# Altium schematic sheet GPS_test.SchDoc
size A; SheetNumber: 3; SheetTotal: 5
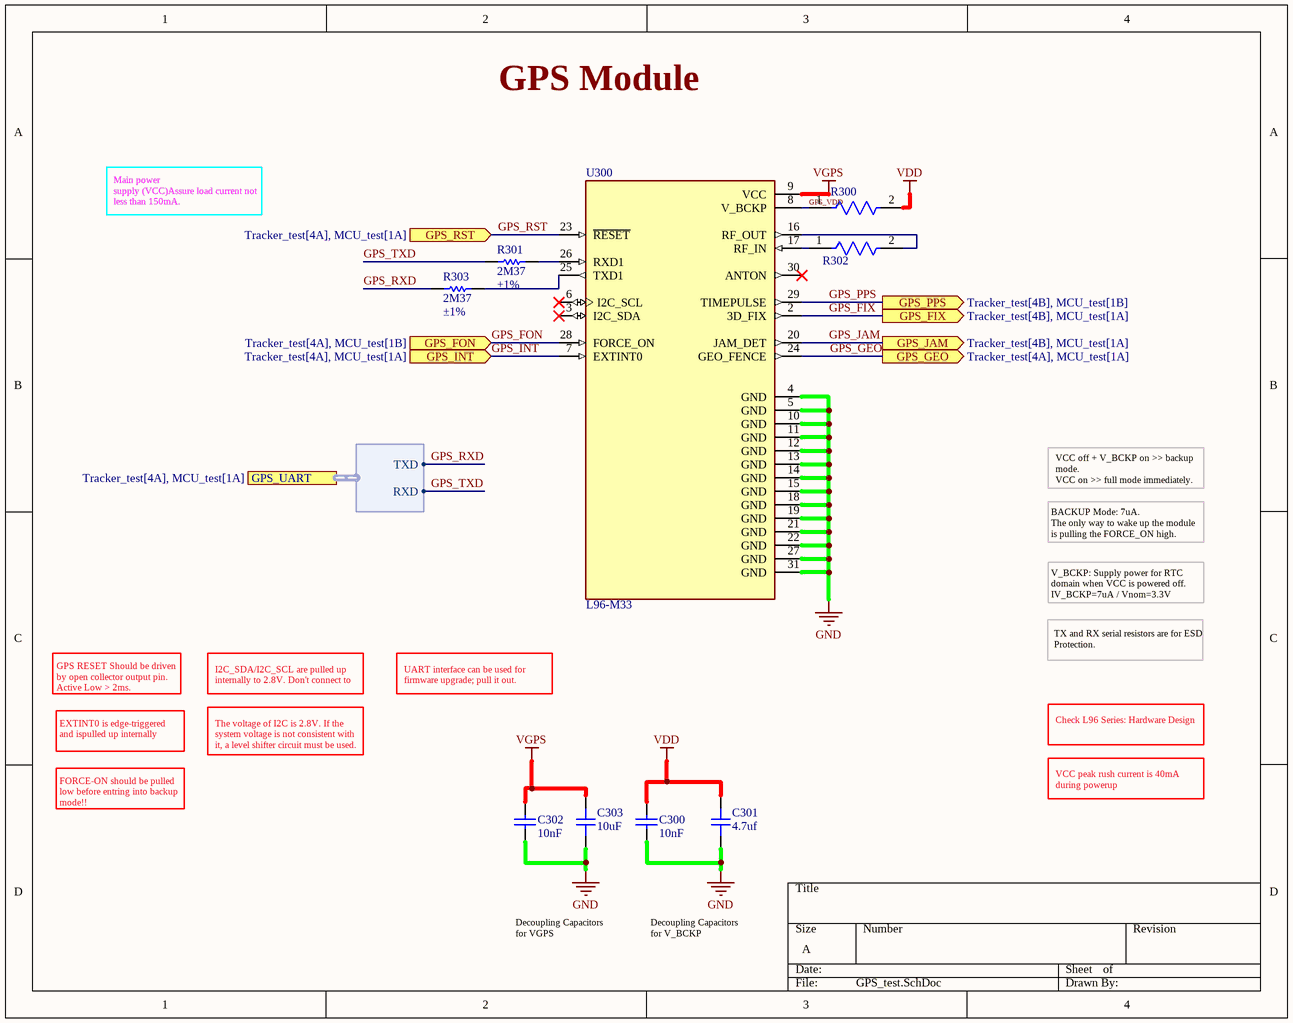
[diagram p0: GPS_test.SchDoc]

## Parts
C300  value 10nF  [C0402 - duplicate]  (hidden comment: CAP)
C301  4.7uf  [CAP_0402]
C302  value 10nF  [C0402 - duplicate]  (hidden comment: CAP)
C303  10uF  [CAP_0402]
R300  AF0402JR-070RL  [FP-AF0402-IPC_A]  (value not drawn)
R301  value 2M37  Tolerance: ±1%  [R0402]  (hidden comment: 100)
R302  AF0402JR-070RL  [FP-AF0402-IPC_A]  (value not drawn)
R303  value 2M37  Tolerance: ±1%  [R0402]  (hidden comment: 100)
U300  L96-M33  [XCVR_L96-M33]

## Ports
GPS_FIX (out, see Tracker_test[4B], MCU_test[1A]), GPS_FON (in, see Tracker_test[4A], MCU_test[1B]), GPS_GEO (out, see Tracker_test[4A], MCU_test[1A]), GPS_INT (in, see Tracker_test[4A], MCU_test[1A]), GPS_JAM (out, see Tracker_test[4B], MCU_test[1A]), GPS_PPS (out, see Tracker_test[4B], MCU_test[1B]), GPS_RST (in, see Tracker_test[4A], MCU_test[1A]), GPS_UART (harness GPS_UART, see Tracker_test[4A], MCU_test[1A])

## Harnesses
GPS_UART: TXD, RXD

## Nets
GND: C300.2 C301.1 C302.2 C303.1 U300.4(GND) U300.5(GND) U300.10(GND) U300.11(GND) U300.12(GND) U300.13(GND) U300.14(GND) U300.15(GND) U300.18(GND) U300.19(GND) U300.21(GND) U300.22(GND) U300.27(GND) U300.31(GND)
VDD: C300.1 C301.2 R300.2
VGPS: C302.1 C303.2 U300.9(VCC)
GPS_FIX: U300.2(3D_FIX) ; port GPS_FIX
GPS_FON: U300.28(FORCE_ON) ; port GPS_FON
GPS_GEO: U300.24(GEO_FENCE) ; port GPS_GEO
GPS_INT: U300.7(EXTINT0) ; port GPS_INT
GPS_JAM: U300.20(JAM_DET) ; port GPS_JAM
GPS_PPS: U300.29(TIMEPULSE) ; port GPS_PPS
GPS_RST: U300.23(~{RESET}) ; port GPS_RST
GPS_RXD: R303.1 ; port GPS_UART.TXD
GPS_TXD: R301.1 ; port GPS_UART.RXD
GPS_VDD: R300.1 U300.8(V_BCKP)
NetR301_2: R301.2 U300.26(RXD1)
NetR302_1: R302.1 U300.17(RF_IN)
NetR302_2: R302.2 U300.16(RF_OUT)
NetR303_2: R303.2 U300.25(TXD1)

Not connected (* = marked no-connect by the designer): U300 3(I2C_SDA)* 6(I2C_SCL)* 30(ANTON)*

## Notes on the sheet
- GPS Module
- Main power
  supply (VCC)Assure load current not
  less than 150mA.
- VCC off + V_BCKP on >> backup mode.
  VCC on >> full mode immediately.
- BACKUP Mode: 7uA.
  The only way to wake up the module is pulling the FORCE_ON high.
- V_BCKP: Supply power for RTC
  domain when VCC is powered off.
  IV_BCKP=7uA / Vnom=3.3V
- GPS RESET Should be driven by open collector output pin.
  Active Low > 2ms.
- I2C_SDA/I2C_SCL are pulled up internally to 2.8V. Don't connect to
- UART interface can be used for firmware upgrade; pull it out.
- TX and RX serial resistors are for ESD Protection.
- EXTINT0 is edge-triggered and ispulled up internally
- The voltage of I2C is 2.8V. If the system voltage is not consistent with it, a level shifter circuit must be used.
- Check L96 Series: Hardware Design
- FORCE-ON should be pulled low before entring into backup mode!!
- VCC peak rush current is 40mA during powerup
- Decoupling Capacitors for VGPS
- Decoupling Capacitors for V_BCKP

## Library data of the parts
C300 C302 = CAP: CAP CER 0.1UF 10V X7R 0603; Part Number: C00062; Manufacturer: KEMET - Electronic Component; Manufacturer Part Number: C0603C104K8RACTU; Tolerance: ±10%; Supplier 1: Digi-Key; Supplier Part Number 1: 399-1095-2-ND; HelpURL: http://www.kemet.com/Lists/ProductCatalog/Attachments/53/KEM_C1002_X7R_SMD.pdf; Operating Temperature: -55°C ~ 125°C; Type: CER; Temperature Coefficient: X7R; Voltage: 10V
C301 C303 = CAP_0402: Capacitor SMD 0402; Manufacturer: *; Manufacturer Part Number: *; Distributor Link: *; LCSC: *; Rating: *; Dielectric: *
R300 R302 = CMP-03412-048355-1: Anti-Sulfurated Chip Resistors Automotive Grade 0Ω 0402; Tolerance: 5%; Resistance: 0R; Max Power Dissipation: 63mW; Case Code (Metric): 1005; Packaging: Tape and Reel; Features: Moisture Resistant; Termination: SMD/SMT; Package Quantity: 10000; RoHS Compliant: Yes; Case/Package: 0402; Number of Terminations: 2; Series: AF; Length: 0.039inch; Max Operating Temperature: 155°C; Min Operating Temperature: -55°C; Resistor Type: Thick Film; Height: 0.015inch; Weight: 2.3E-05oz; Width: 0.5mm; Case Code (Imperial): 0402
R301 R303 = RES: RES SMD 15 OHM 1% 1/10W 0603; Part Number: R00007; Manufacturer: Yageo; Manufacturer Part Number: RC0603FR-0715RL; Temperature Coefficient: ±100ppm/°C; Supplier 1: Digi-Key; Supplier Part Number 1: 311-15.0HRCT-ND; HelpURL: http://www.yageo.com/NewPortal/yageodocoutput?fileName=/pdf/R-Chip/PYu-RC_Group_51_RoHS_L_3.pdf; Power: 1/10W; Operating Temperature: -55°C ~ 155°C
U300 = L96-M33: L96 is a concurrent multi-GNSS receiver module with embedded chip antenna. With 33 tracking channels, 99 acquisition channels and 210 PRN channels, L96 supports concurrent reception of up to three GNSS systems (GPS+GLONASS+Galileo); MF: Quectel; SnapEDA_Link: https://www.snapeda.com/parts/L96-M33/Quectel/view-part/2780781/?ref=snap; Price: None; MP: L96-M33; Availability: Unavailable; Value: *; Package: None